# EAGLE design brain_rev_3 (EAGLE 6.3)
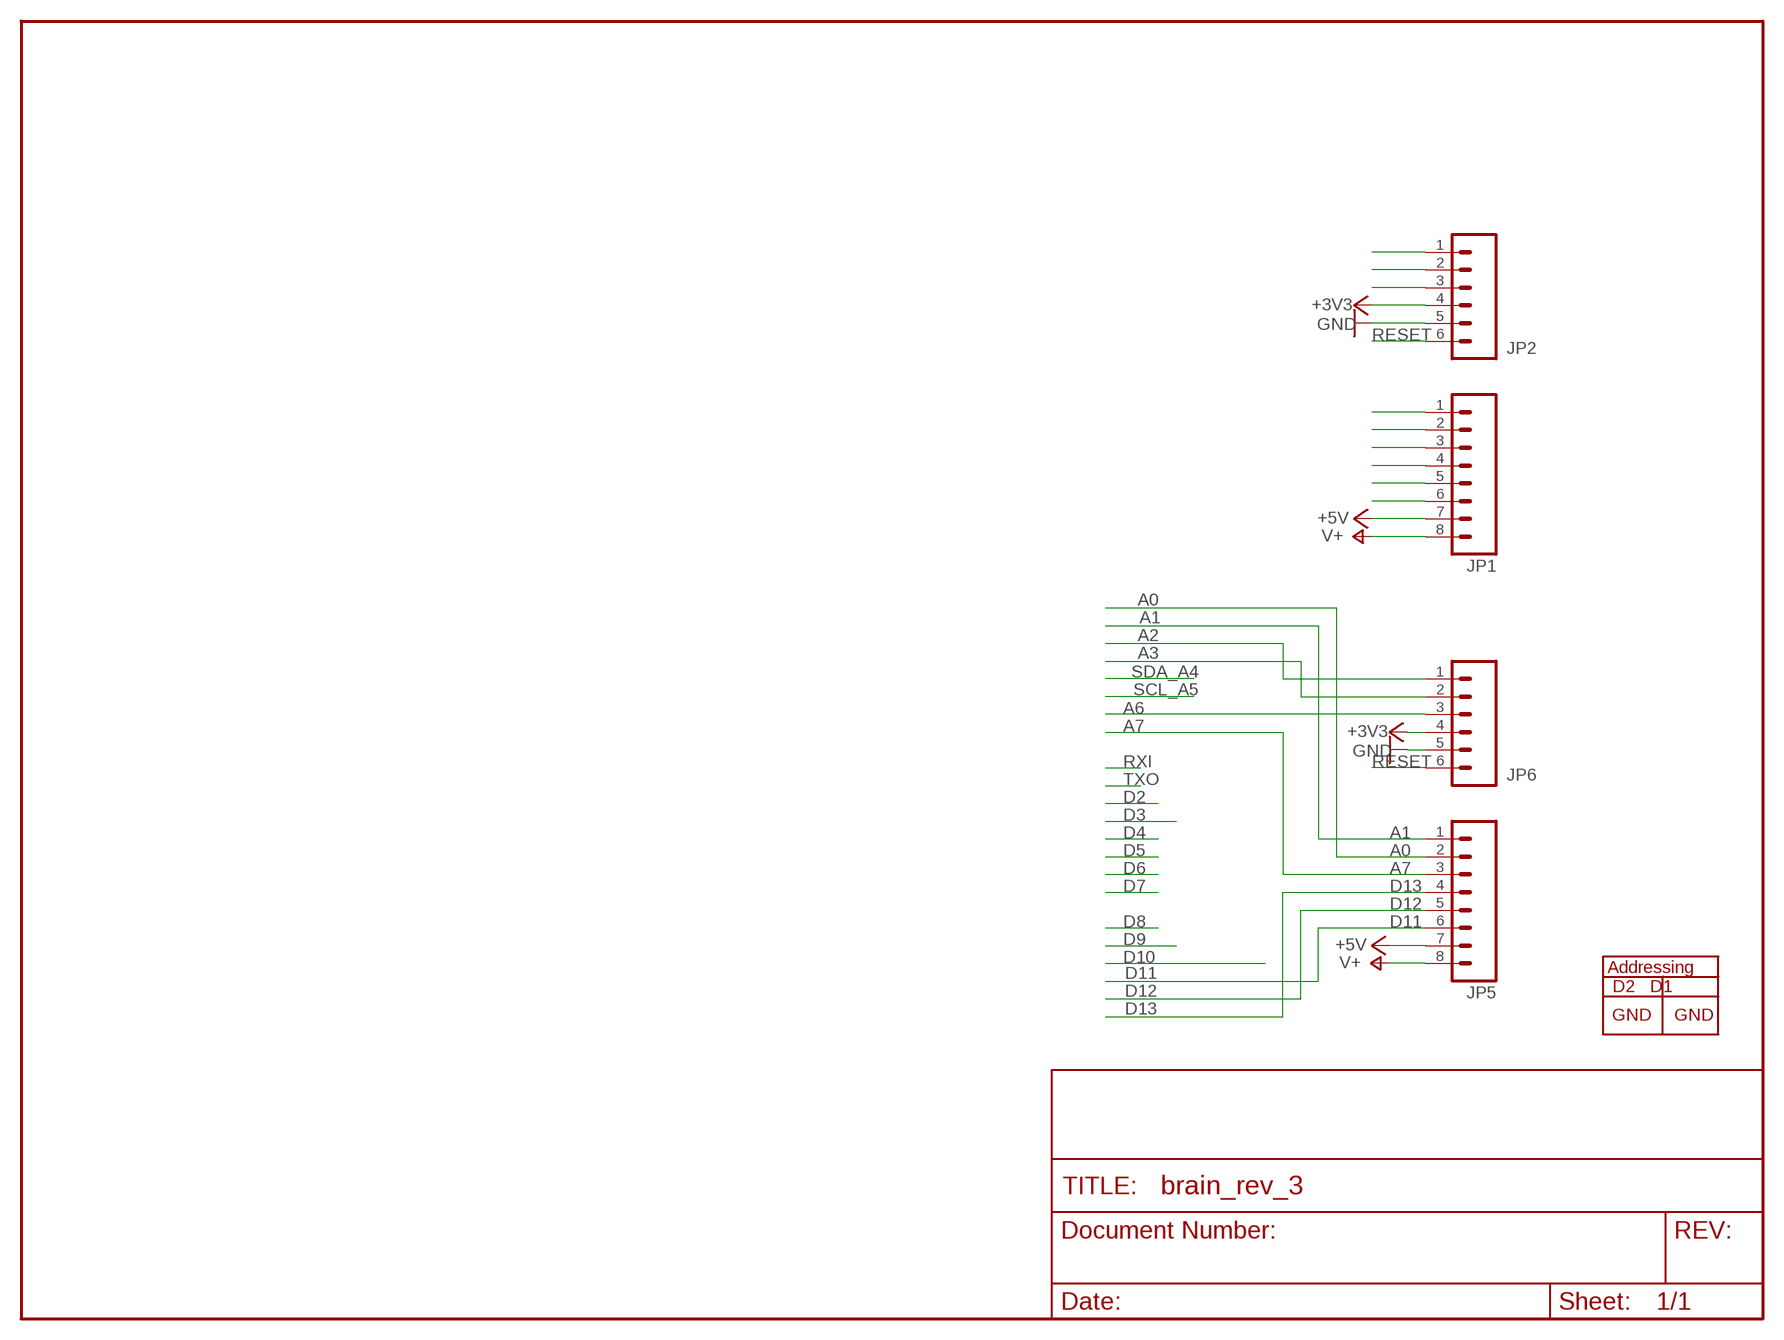
[diagram p0: schematic, sheet 1]

## Parts
JP1  M081X08  [1X08]
JP2  M06SIP  [1X06]
JP5  M081X08  [1X08]
JP6  M06SIP  [1X06]

## Nets
+3V3: JP2.4 JP6.4
+5V: JP1.7 JP5.7
A0: JP5.2
A1: JP5.1
A2: JP6.1
A3: JP6.2
A6: JP6.3
A7: JP5.3
D11: JP5.6
D12: JP5.5
D13: JP5.4
GND: JP2.5 JP6.5
N$3: JP1.6
N$4: JP1.5
N$5: JP1.4
N$6: JP1.3
N$7: JP1.2
N$8: JP1.1
N$12: JP2.3
N$13: JP2.2
N$14: JP2.1
RESET: JP2.6 JP6.6
V+: JP1.8 JP5.8

## Library data of the parts
JP1 JP5 = SparkFun_mod:M08: Header 8 Standard 8-pin 0.1" header. Use with straight break away headers (SKU : PRT-00116), right angle break away headers (PRT-00553), swiss pins (PRT-00743), machine pins (PRT-00117), and female headers (PRT-00115).
JP2 JP6 = SparkFun:M06: Header 6 Standard 6-pin 0.1" header. Use with straight break away headers (SKU : PRT-00116), right angle break away headers (PRT-00553), swiss pins (PRT-00743), machine pins (PRT-00117), and female headers (PRT-00115). Molex polarized connector foot print use with SKU : PRT-08094 with associated crimp pins and housings. NOTES ON THE VARIANTS LOCK and LOCK_LONGPADS... This footprint was designed to help hold the alignment of a through-hole component (i.e. 6-pin header) while soldering it into place. You may notice that each hole has been shifted either up or down by 0.005 of an inch from it's more standard position (which is a perfectly straight line). This slight alteration caused the pins (the squares in the middle) to touch the edges of the holes. Because they are alternating, it causes a "brace" to hold the component in place. 0.005 has proven to be the perfect amount of "off-center" position when using our standard breakaway headers. Although looks a little odd when you look at the bare footprint, once you have a header in there, the alteration is very hard to notice. Also, if you push a header all the way into place, it is covered up entirely on the bottom side. This idea of altering the position of holes to aid alignment will be further integrated into the Sparkfun Library for other footprints. It can help hold any component with 3 or more connection pins.

## Net classes
0 default: width 0.203 mm
1 vcc: width 0.254 mm

## Board
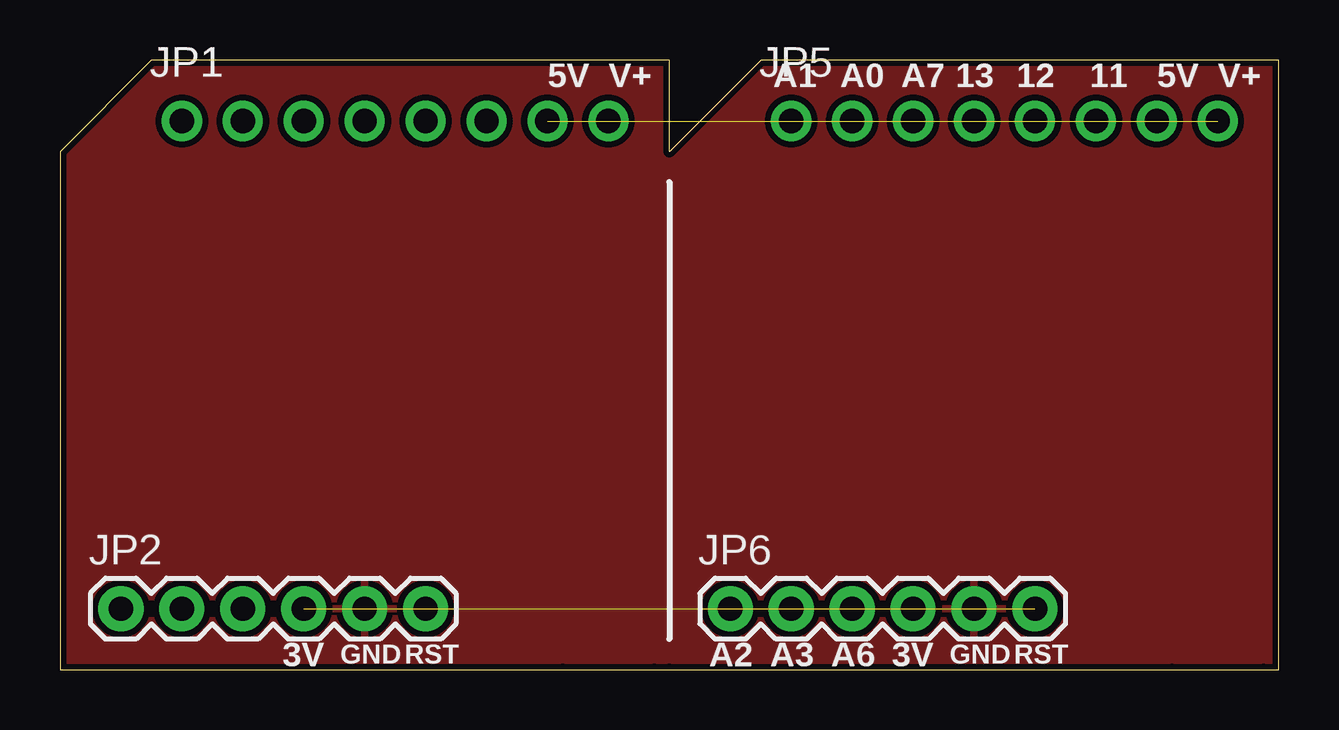
[diagram p1: board, top side]
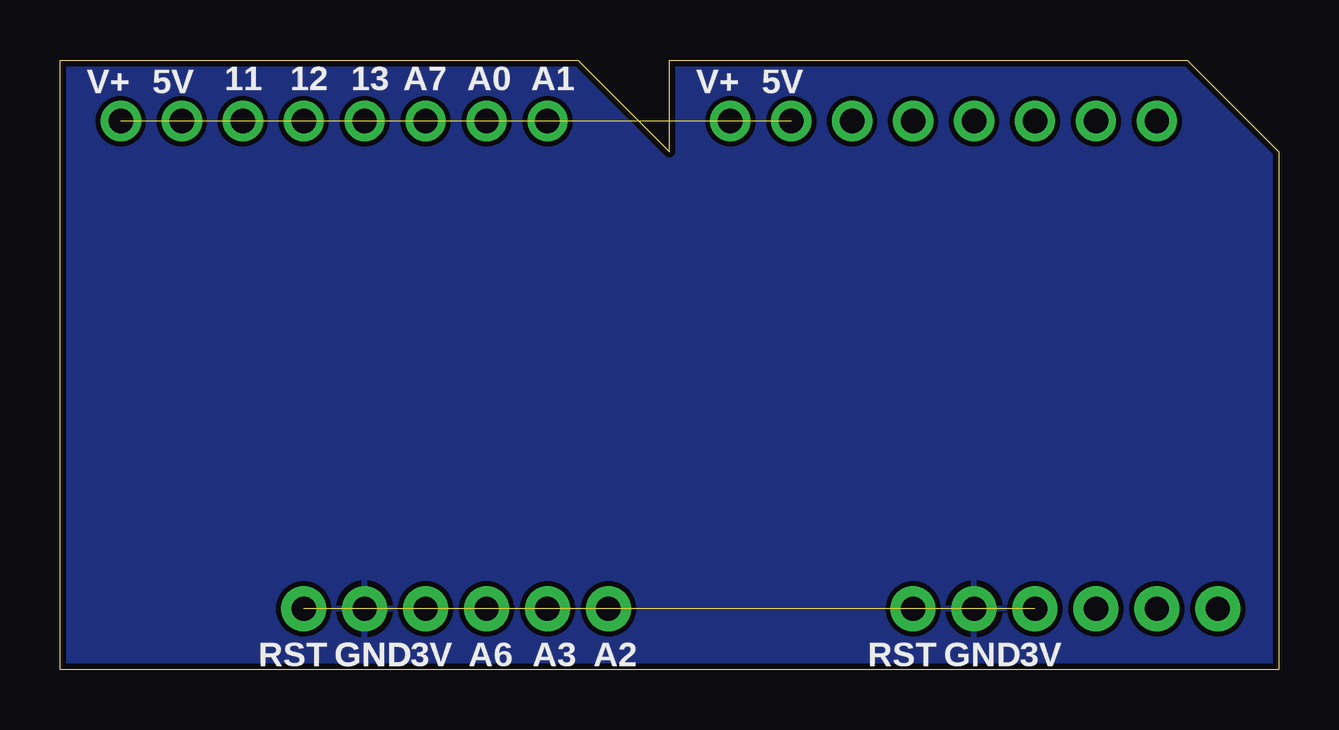
[diagram p2: board, bottom side, seen from below]

Size 50.8 x 25.4 mm. Coordinates in mm from the lower left corner, seen from the top.
Outline: 50.8,25.4 50.8,21.59 50.8,0 50.17,0 46.36,0 25.4,0 24.77,0 20.96,0 0,0 0,21.59
Outline: 50.8,25.4 29.21,25.4 25.4,21.59
Outline: 25.4,21.59 25.4,21.59
Outline: 25.4,21.59 25.4,25.4
Outline: 25.4,25.4 3.81,25.4 0,21.59
Outline: 0,21.59 0,21.59
Copper layers (1*16): Top 0.035mm / dielectric 1.5mm / Bottom 0.035mm
Design rules "SparkFun": minimum track width 8mil, minimum drill 20mil, track to track 8mil, track to pad 8mil, pad to pad 8mil, via to via 8mil, smd to smd 8mil, copper to edge 10mil, drill to drill 8mil, minimum pad ring 12mil, minimum via ring 10mil, stop-mask expansion 4mil, vias tented up to drill 25mil, thermal gap 10mil

### Footprints (pad centres in the part's own frame; a part is rotated, then mirrored left to right if it is on the bottom)
1X08 = drill 1.016 pad 1.676: 1 0,0; 2 2.54,0; 3 5.08,0; 4 7.62,0; 5 10.16,0; 6 12.7,0; 7 15.24,0; 8 17.78,0
1X06 = drill 1.016 pad 1.88: 1 0,0; 2 2.54,0; 3 5.08,0; 4 7.62,0; 5 10.16,0; 6 12.7,0

### Placement (x,y rotation side)
JP1  5.08,22.86 0 top
JP2  2.54,2.54 0 top
JP5  30.48,22.86 0 top
JP6  27.94,2.54 0 top

### Tracks (layer width: path | path; a pad name or v marks a point on that pad's centre or on a via)
+3V3  (1 unrouted)
+5V  (1 unrouted)
GND  (1 unrouted)
  pour Bottom: -2.54,26.67 52.07,26.67 52.07,-1.27 -2.54,-1.27
  pour Top (isolate 0.254): -1.91,26.04 52.07,26.04 52.07,0 51.44,-0.64 -1.91,-0.64
RESET  (1 unrouted)
V+  (1 unrouted)

### Text on the board
tPlace: 5V | V+ | A1 | A0 | A7 | 13 | 12 | 11 | 5V | V+ | MakersBox.blogspot.com | NODE | Atmega328 | 3V | GND | RST | A2 | A3 | A6 | 3V | GND | RST
bPlace: 5V | V+ | A1 | A0 | A7 | 13 | 12 | 5V | V+ | 11 | i2c | NODE | Apr 12 | 3V | GND | RST | A2 | A3 | A6 | 3V | GND | GND | RST | MakersBox.blogspot.com